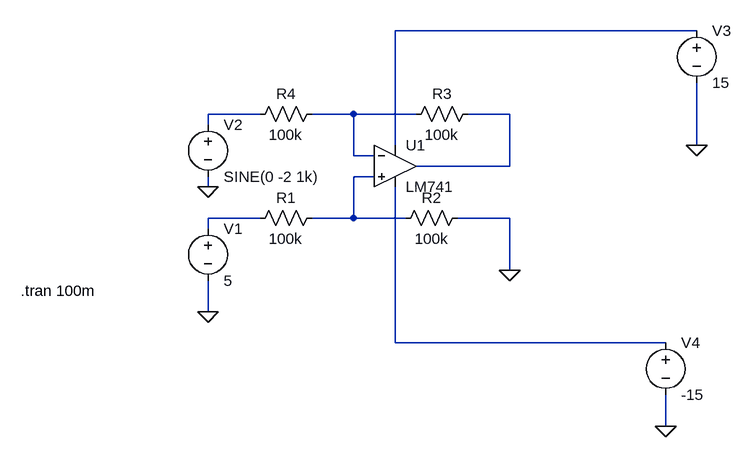
[diagram p0: schematic fark_kuvvetlendirici_lm741.asc]
fark_kuvvetlendirici_lm741.asc, the LTspice schematic file:
Version 4
SHEET 1 880 680
WIRE 768 -32 304 -32
WIRE 96 96 16 96
WIRE 240 96 176 96
WIRE 336 96 240 96
WIRE 480 96 416 96
WIRE 16 112 16 96
WIRE 304 144 304 -32
WIRE 768 144 768 48
WIRE 240 160 240 96
WIRE 272 160 240 160
WIRE 480 176 480 96
WIRE 480 176 336 176
WIRE 272 192 240 192
WIRE 16 208 16 192
WIRE 96 256 16 256
WIRE 240 256 240 192
WIRE 240 256 176 256
WIRE 320 256 240 256
WIRE 480 256 400 256
WIRE 16 272 16 256
WIRE 480 336 480 256
WIRE 16 400 16 352
WIRE 304 448 304 208
WIRE 720 448 304 448
WIRE 720 576 720 528
FLAG 16 400 0
FLAG 480 336 0
FLAG 16 208 0
FLAG 768 144 0
FLAG 720 576 0
SYMBOL OpAmps\\LM741 304 112 R0
SYMATTR InstName U1
SYMBOL res 192 240 R90
WINDOW 0 0 56 VBottom 2
WINDOW 3 32 56 VTop 2
SYMATTR InstName R1
SYMATTR Value 100k
SYMBOL voltage 16 256 R0
WINDOW 123 0 0 Left 0
WINDOW 39 0 0 Left 0
SYMATTR InstName V1
SYMATTR Value 5
SYMBOL res 416 240 R90
WINDOW 0 0 56 VBottom 2
WINDOW 3 32 56 VTop 2
SYMATTR InstName R2
SYMATTR Value 100k
SYMBOL res 432 80 R90
WINDOW 0 0 56 VBottom 2
WINDOW 3 32 56 VTop 2
SYMATTR InstName R3
SYMATTR Value 100k
SYMBOL res 192 80 R90
WINDOW 0 0 56 VBottom 2
WINDOW 3 32 56 VTop 2
SYMATTR InstName R4
SYMATTR Value 100k
SYMBOL voltage 16 96 R0
WINDOW 123 0 0 Left 0
WINDOW 39 0 0 Left 0
SYMATTR InstName V2
SYMATTR Value SINE(0 -2 1k)
SYMBOL voltage 768 -48 R0
WINDOW 123 0 0 Left 0
WINDOW 39 0 0 Left 0
SYMATTR InstName V3
SYMATTR Value 15
SYMBOL voltage 720 432 R0
WINDOW 123 0 0 Left 0
WINDOW 39 0 0 Left 0
SYMATTR InstName V4
SYMATTR Value -15
TEXT -272 368 Left 2 !.tran 100m

The netlist it stands for:
* fark_kuvvetlendirici_lm741.asc
XU1 N005 N003 N001 N007 N004 LM741  ; pins In+ In- V+ V- OUT
R1 N005 N006 100k
V1 N006 0 5
R2 0 N005 100k
R3 N004 N003 100k
R4 N003 N002 100k
V2 N002 0 SINE(0 -2 1k)
V3 N001 0 15
V4 N007 0 -15
.tran 100m
.lib LM741.lib
.backanno
.end